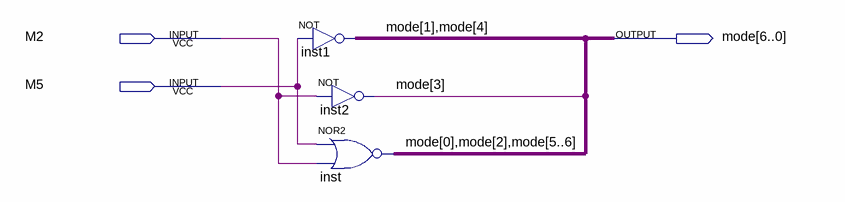
[diagram p0: schematic sheet]
// Quartus schematic modeDecoder.bdf as structural Verilog: 3 symbols, 3 pins
module modeDecoder (
  input  M2,
  input  M5,
  output [6:0] mode
);

  assign {mode[1], mode[4]} = ~{2{M5}};  // NOT inst1, 2 bits wide
  not inst2 (mode[3], M2);
  assign {mode[0], mode[2], mode[5], mode[6]} = ~({4{M5}} | {4{M2}});  // NOR2 inst, 4 bits wide
endmodule
